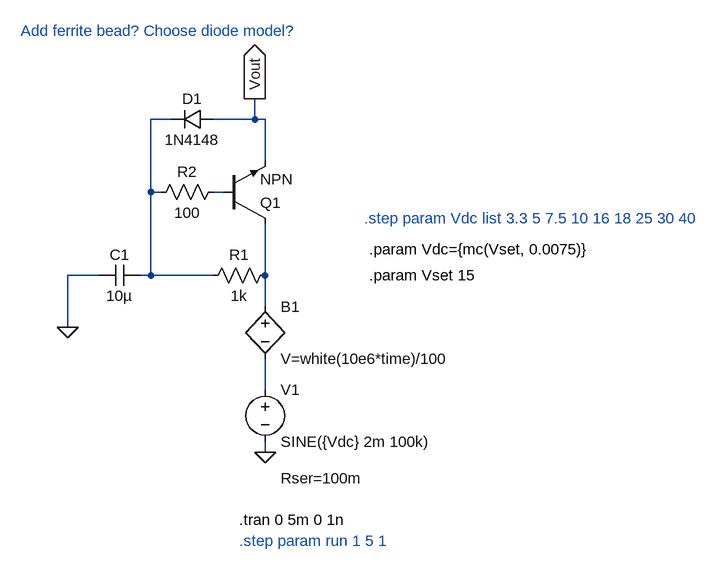
[diagram p0: schematic powersupply.asc]
powersupply.asc, the LTspice schematic file:
Version 4
SHEET 1 880 680
WIRE 16 -144 -16 -144
WIRE 144 -144 144 -176
WIRE 144 -144 80 -144
WIRE 160 -144 144 -144
WIRE 160 -80 160 -144
WIRE -16 -32 -16 -144
WIRE 0 -32 -16 -32
WIRE 96 -32 80 -32
WIRE -96 96 -144 96
WIRE -16 96 -16 -32
WIRE -16 96 -32 96
WIRE 80 96 -16 96
WIRE 160 96 160 16
WIRE 160 144 160 96
WIRE -144 176 -144 96
WIRE 160 272 160 224
WIRE 160 368 160 352
FLAG 160 368 0
FLAG 144 -176 Vout
IOPIN 144 -176 Out
FLAG -144 176 0
SYMBOL voltage 160 256 R0
WINDOW 123 24 124 Left 2
WINDOW 39 24 152 Left 2
SYMATTR SpiceLine Rser=100m
SYMATTR InstName V1
SYMATTR Value SINE({Vdc} 2m 100k)
SYMBOL bv 160 128 R0
SYMATTR InstName B1
SYMATTR Value V=white(10e6*time)/100
SYMBOL res 176 80 R90
WINDOW 0 0 56 VBottom 2
WINDOW 3 32 56 VTop 2
SYMATTR InstName R1
SYMATTR Value 1k
SYMBOL cap -32 80 R90
WINDOW 0 0 32 VBottom 2
WINDOW 3 32 32 VTop 2
SYMATTR InstName C1
SYMATTR Value 10µ
SYMBOL diode 80 -160 R90
WINDOW 0 0 32 VBottom 2
WINDOW 3 32 32 VTop 2
SYMATTR InstName D1
SYMATTR Value 1N4148
SYMBOL npn 96 16 M180
SYMATTR InstName Q1
SYMBOL res 96 -48 R90
WINDOW 0 0 56 VBottom 2
WINDOW 3 32 56 VTop 2
SYMATTR InstName R2
SYMATTR Value 100
TEXT 312 8 Left 2 ;.step param Vdc list 3.3 5 7.5 10 16 18 25 30 40
TEXT 120 472 Left 2 !.tran 0 5m 0 1n
TEXT 320 56 Left 2 !.param Vdc={mc(Vset, 0.0075)}
TEXT 120 504 Left 2 ;.step param run 1 5 1
TEXT 320 96 Left 2 !.param Vset 15
TEXT -216 -280 Left 2 ;Add ferrite bead? Choose diode model?

The netlist it stands for:
* powersupply.asc
V1 N004 0 SINE({Vdc} 2m 100k) Rser=100m
B1 N003 N004 V=white(10e6*time)/100
R1 N003 N001 1k
C1 N001 0 10µ
D1 Vout N001 1N4148
Q1 N003 N002 Vout 0 NPN
R2 N002 N001 100
.model D D
.lib standard.dio
.model NPN NPN
.model PNP PNP
.lib standard.bjt
* .step param Vdc list 3.3 5 7.5 10 16 18 25 30 40
.tran 0 5m 0 1n
.param Vdc={mc(Vset, 0.0075)}
* .step param run 1 5 1
.param Vset 15
* Add ferrite bead? Choose diode model?
.backanno
.end